# Altium schematic sheet 2312_PIC32.SchDoc
size A3; Author: Miguel Santos; Organization: ETML-ES; Address1: Avenue Recordon 1; Address2: 1004 Lausanne; Address3: Switzerland; SheetNumber: 3; SheetTotal: 7; Version: 1.0
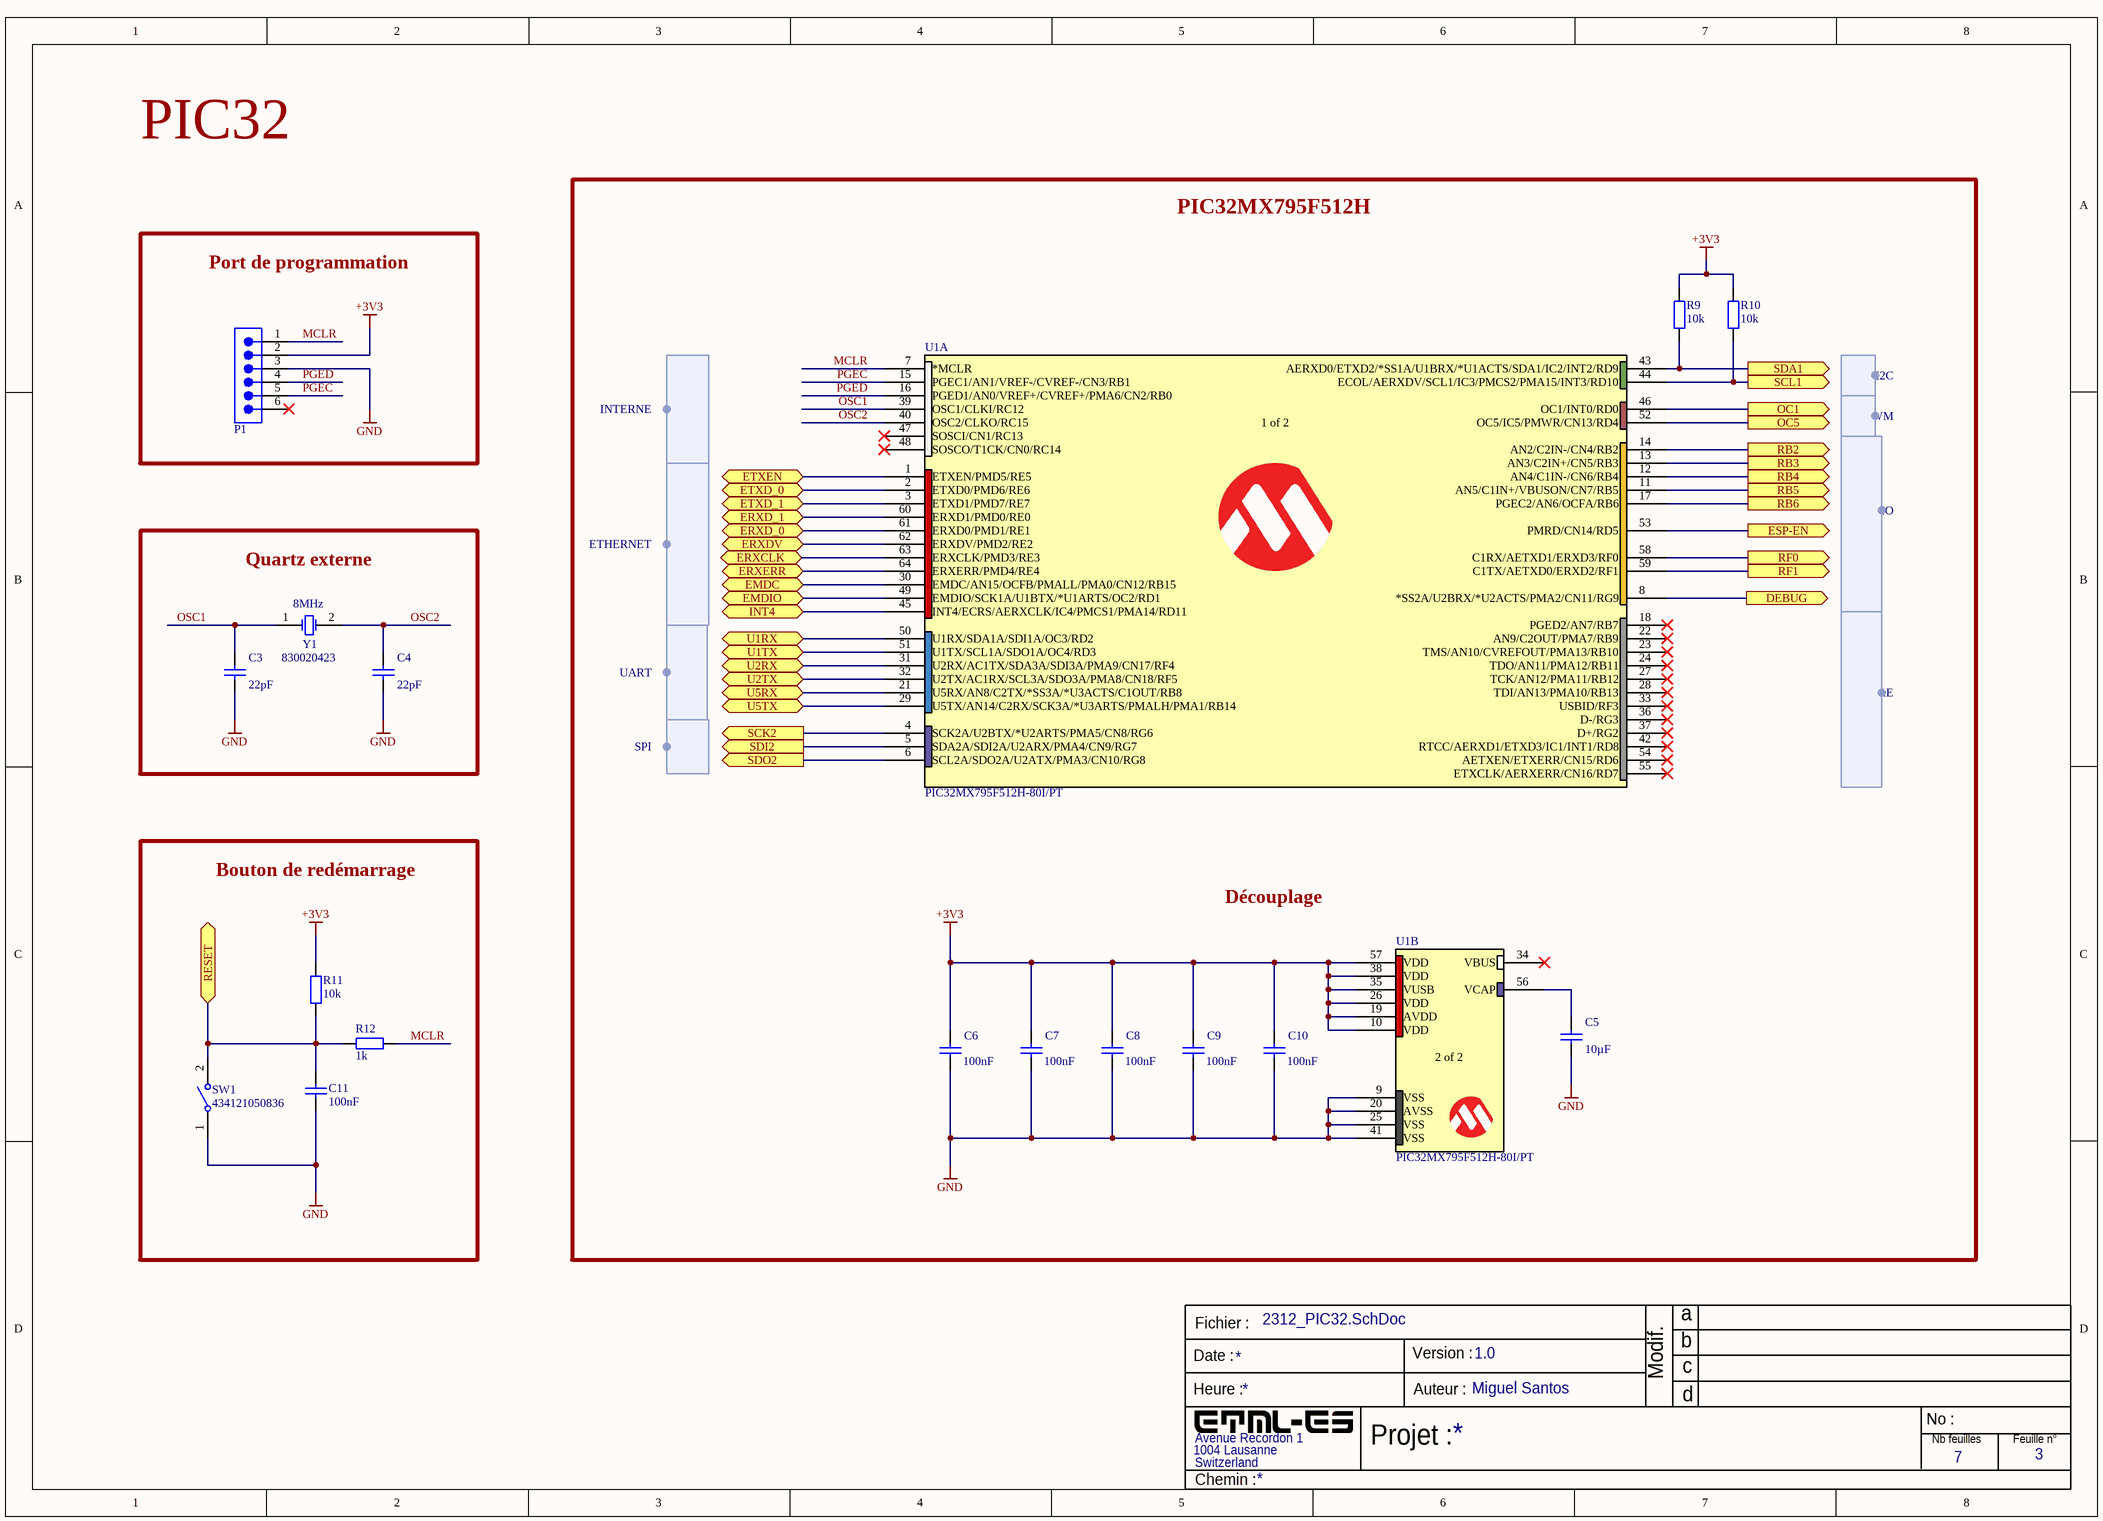
[diagram p0: 2312_PIC32.SchDoc]

## Parts
C3  Capacitance: 22pF  [WCAP-CSGP_0805_L2W1.25H0.6_Reflow]  (hidden comment: 885012007002)
C4  Capacitance: 22pF  [WCAP-CSGP_0805_L2W1.25H0.6_Reflow]  (hidden comment: 885012007002)
C5  Capacitance: 10µF  [WCAP-CSGP_0805_L2W1.25H1.25]  (hidden comment: 885012207003)
C6  Capacitance: 100nF  [WCAP-CSGP_0805_L2W1.25H0.8_Reflow]  (hidden comment: 885012207016)
C7  Capacitance: 100nF  [WCAP-CSGP_0805_L2W1.25H0.8_Reflow]  (hidden comment: 885012207016)
C8  Capacitance: 100nF  [WCAP-CSGP_0805_L2W1.25H0.8_Reflow]  (hidden comment: 885012207016)
C9  Capacitance: 100nF  [WCAP-CSGP_0805_L2W1.25H0.8_Reflow]  (hidden comment: 885012207016)
C10  Capacitance: 100nF  [WCAP-CSGP_0805_L2W1.25H0.8_Reflow]  (hidden comment: 885012207016)
C11  Capacitance: 100nF  [WCAP-CSGP_0805_L2W1.25H0.8_Reflow]  (hidden comment: 885012207016)
P1  61300611121  [61300611121]  (value not drawn)
R9  Resistance: 10k  [2312-RES-0805]  (hidden comment: RES-0805)
R10  Resistance: 10k  [2312-RES-0805]  (hidden comment: RES-0805)
R11  Resistance: 10k  [2312-RES-0805]  (hidden comment: RES-0805)
R12  Resistance: 1k  [2312-RES-0805]  (hidden comment: RES-0805)
SW1  434121050836  [WS-TASV_L6W3.5H5_4341x10508x6]
U1  PIC32MX795F512H-80I/PT  [TQFP64_10x10MC_MCH]  (parts A,B of 2)
Y1  830020423  Frequency: 8MHz  [WE-XTAL_HC49/4HSMX]

## Blocks framed on the sheet
PIC32MX795F512H: C5-C10 R9 R10 U1
Port de programmation: P1
Quartz externe: C3 C4 Y1
Bouton de redémarrage: C11 R11 R12 SW1

## Ports
DEBUG (out), EMDC (bidir), EMDIO (bidir), ERXCLK (bidir), ERXD_0 (bidir), ERXD_1 (bidir), ERXDV (bidir), ERXERR (bidir), ESP-EN (out), ETXD_0 (bidir), ETXD_1 (bidir), ETXEN (bidir), INT4 (bidir), OC1 (out), OC5 (out), RB2 (out), RB3 (out), RB4 (out), RB5 (out), RB6 (out), RESET (bidir), RF0 (out), RF1 (out), SCK2 (out), SCL1 (out), SDA1 (out), SDI2 (out), SDO2 (out), U1RX (bidir), U1TX (bidir), U2RX (bidir), U2TX (bidir), U5RX (bidir), U5TX (bidir)

## Harnesses
?: 

## Nets
+3V3: C6.2 C7.2 C8.2 C9.2 C10.2 P1.2 R9.2 R10.1 R11.1 U1.10(VDD) U1.19(AVDD) U1.26(VDD) U1.35(VUSB) U1.38(VDD) U1.57(VDD)
GND: C3.1 C4.2 C5.1 C6.1 C7.1 C8.1 C9.1 C10.1 C11.2 P1.3 SW1.1 U1.9(VSS) U1.20(AVSS) U1.25(VSS) U1.41(VSS)
DEBUG: U1.8(*SS2A/U2BRX/*U2ACTS/PMA2/CN11/RG9) ; port DEBUG
EMDC: U1.30(EMDC/AN15/OCFB/PMALL/PMA0/CN12/RB15) ; port EMDC
EMDIO: U1.49(EMDIO/SCK1A/U1BTX/*U1ARTS/OC2/RD1) ; port EMDIO
ERXCLK: U1.63(ERXCLK/PMD3/RE3) ; port ERXCLK
ERXD_0: U1.61(ERXD0/PMD1/RE1) ; port ERXD_0
ERXD_1: U1.60(ERXD1/PMD0/RE0) ; port ERXD_1
ERXDV: U1.62(ERXDV/PMD2/RE2) ; port ERXDV
ERXERR: U1.64(ERXERR/PMD4/RE4) ; port ERXERR
ESP-EN: U1.53(PMRD/CN14/RD5) ; port ESP-EN
ETXD_0: U1.2(ETXD0/PMD6/RE6) ; port ETXD_0
ETXD_1: U1.3(ETXD1/PMD7/RE7) ; port ETXD_1
ETXEN: U1.1(ETXEN/PMD5/RE5) ; port ETXEN
INT4: U1.45(INT4/ECRS/AERXCLK/IC4/PMCS1/PMA14/RD11) ; port INT4
MCLR: P1.1 R12.2 U1.7(*MCLR)
OC1: U1.46(OC1/INT0/RD0) ; port OC1
OC5: U1.52(OC5/IC5/PMWR/CN13/RD4) ; port OC5
OSC1: C3.2 U1.39(OSC1/CLKI/RC12) Y1.1(OSC1)
OSC2: C4.1 U1.40(OSC2/CLKO/RC15) Y1.2(OSC2)
PGEC: P1.5 U1.15(PGEC1/AN1/VREF-/CVREF-/CN3/RB1)
PGED: P1.4 U1.16(PGED1/AN0/VREF+/CVREF+/PMA6/CN2/RB0)
RB2: U1.14(AN2/C2IN-/CN4/RB2) ; port RB2
RB3: U1.13(AN3/C2IN+/CN5/RB3) ; port RB3
RB4: U1.12(AN4/C1IN-/CN6/RB4) ; port RB4
RB5: U1.11(AN5/C1IN+/VBUSON/CN7/RB5) ; port RB5
RB6: U1.17(PGEC2/AN6/OCFA/RB6) ; port RB6
RESET: C11.1 R11.2 R12.1 SW1.2 ; port RESET
RF0: U1.58(C1RX/AETXD1/ERXD3/RF0) ; port RF0
RF1: U1.59(C1TX/AETXD0/ERXD2/RF1) ; port RF1
SCK2: U1.4(SCK2A/U2BTX/*U2ARTS/PMA5/CN8/RG6) ; port SCK2
SCL1: R10.2 U1.44(ECOL/AERXDV/SCL1/IC3/PMCS2/PMA15/INT3/RD10) ; port SCL1
SDA1: R9.1 U1.43(AERXD0/ETXD2/*SS1A/U1BRX/*U1ACTS/SDA1/IC2/INT2/RD9) ; port SDA1
SDI2: U1.5(SDA2A/SDI2A/U2ARX/PMA4/CN9/RG7) ; port SDI2
SDO2: U1.6(SCL2A/SDO2A/U2ATX/PMA3/CN10/RG8) ; port SDO2
U1RX: U1.50(U1RX/SDA1A/SDI1A/OC3/RD2) ; port U1RX
U1TX: U1.51(U1TX/SCL1A/SDO1A/OC4/RD3) ; port U1TX
U2RX: U1.31(U2RX/AC1TX/SDA3A/SDI3A/PMA9/CN17/RF4) ; port U2RX
U2TX: U1.32(U2TX/AC1RX/SCL3A/SDO3A/PMA8/CN18/RF5) ; port U2TX
U5RX: U1.21(U5RX/AN8/C2TX/*SS3A/*U3ACTS/C1OUT/RB8) ; port U5RX
U5TX: U1.29(U5TX/AN14/C2RX/SCK3A/*U3ARTS/PMALH/PMA1/RB14) ; port U5TX
NetC5_2: C5.2 U1.56(VCAP)

Not connected (* = marked no-connect by the designer): P1 6*; U1 18(PGED2/AN7/RB7)* 22(AN9/C2OUT/PMA7/RB9)* 23(TMS/AN10/CVREFOUT/PMA13/RB10)* 24(TDO/AN11/PMA12/RB11)* 27(TCK/AN12/PMA11/RB12)* 28(TDI/AN13/PMA10/RB13)* 33(USBID/RF3)* 34(VBUS)* 36(D-/RG3)* 37(D+/RG2)* 42(RTCC/AERXD1/ETXD3/IC1/INT1/RD8)* 47(SOSCI/CN1/RC13)* 48(SOSCO/T1CK/CN0/RC14)* 54(AETXEN/ETXERR/CN15/RD6)* 55(ETXCLK/AERXERR/CN16/RD7)*

## Notes on the sheet
- PIC32
- I2C
- INTERNE
- PWM
- GPIO
- ETHERNET
- UART
- LIBRE
- SPI
- Découplage
- Fichier :
- a
- Date :
- Heure :
- Version :
- Auteur :
- Modif.
- b
- c
- d
- Projet :
- No :
- Nb feuilles
- Feuille n°
- Chemin :
- (in symbol PIC32MX795F512H-80I/PT, part A) 1 of 2
- (in symbol PIC32MX795F512H-80I/PT, part B) 2 of 2

## Library data of the parts
C3 C4 = 885012007002: WCAP-CSGP Multilayer Ceramic Chip Capacitor, General Purpose, size 0805, NP0, 22pF, 10VDC; Manufacturer: Wurth Elektronik; Case/Size Code: 0805; Capacitance Tolerance: +/-5%; Insulation Resistance: 10GΩ; Q Factor: 840; Rated Voltage (DC): 10V; Technical Reference: NP00805220J010DFCT10000; Manufacturer Part Number: 885012007002; Category: Multilayer Ceramic Chip Capacitors; Match Code: WCAP-CSGP; ComponentLink1Description: Website Link; ComponentLink1URL: https://www.we-online.com/redexpert/article/885012007002?ad; ComponentLink2Description: Datasheet Link; ComponentLink2URL: https://www.we-online.com/redexpert/spec/885012007002?ad; Mount: Surface Mount; Operating Temperature Max: 125°C; Operating Temperature Min: -55°C; Packaging: Tape and Reel; Length: 2mm; Width: 1.25mm; Height: 0.6mm; Ceramic Type: NP0
C5 = 885012207003: WCAP-CSGP Multilayer Ceramic Chip Capacitor, General Purpose, size 0805, X7R, 10µF, 6.3VDC; Manufacturer: Wurth Elektronik; Case/Size Code: 0805; Capacitance Tolerance: +/-10%; Dissipation Factor: 10%; Insulation Resistance: 0.01GΩ; Rated Voltage (DC): 6.3V; Technical Reference: X7R0805106K6R3DFCT10000; Manufacturer Part Number: 885012207003; Category: Multilayer Ceramic Chip Capacitors; Match Code: WCAP-CSGP; ComponentLink1Description: Website Link; ComponentLink1URL: https://www.we-online.com/redexpert/article/885012207003?ad; ComponentLink2Description: Datasheet Link; ComponentLink2URL: https://www.we-online.com/redexpert/spec/885012207003?ad; Mount: Surface Mount; Operating Temperature Max: 125°C; Operating Temperature Min: -55°C; Packaging: Tape and Reel; Length: 2mm; Width: 1.25mm; Height: 1.25mm; Ceramic Type: X7R
C6-C11 = 885012207016: WCAP-CSGP Multilayer Ceramic Chip Capacitor, General Purpose, size 0805, X7R, 100nF, 10VDC; Manufacturer: Wurth Elektronik; Case/Size Code: 0805; Capacitance Tolerance: +/-10%; Dissipation Factor: 5%; Insulation Resistance: 5GΩ; Rated Voltage (DC): 10V; Technical Reference: X7R0805104K010DFCT10000; Manufacturer Part Number: 885012207016; Category: Multilayer Ceramic Chip Capacitors; Match Code: WCAP-CSGP; ComponentLink1Description: Website Link; ComponentLink1URL: https://www.we-online.com/redexpert/article/885012207016?ad; ComponentLink2Description: Datasheet Link; ComponentLink2URL: https://www.we-online.com/redexpert/spec/885012207016?ad; Mount: Surface Mount; Operating Temperature Max: 125°C; Operating Temperature Min: -55°C; Packaging: Tape and Reel; Length: 2mm; Width: 1.25mm; Height: 0.8mm; Ceramic Type: X7R
P1 = 61300611121: WR-PHD Pin Header, THT, Vertical, pitch 2.54mm, 1 Row, 6P; Manufacturer: Wurth Elektronik; Contact Resistance: 20mΩ; Rated Current: 3A; Working Voltage: 250V; Withstanding Voltage: 500V; ComponentLink1Description: Website Link; ComponentLink1URL: https://www.we-online.com/redexpert/article/61300611121?ad; ComponentLink2Description: Datasheet Link; ComponentLink2URL: https://www.we-online.com/redexpert/spec/61300611121?ad; Manufacturer Part Number: 61300611121; Category: Board-to-Board Connectors; Match Code: WR-PHD; Mount: Through Hole; Operating Temperature Max: 105°C; Operating Temperature Min: -40°C; Packaging: Bag; Gender: Pin Header; Number of Pins: 6; Number of Rows: 1; Orientation: Vertical; Pitch: 2.54mm
R9-R11 = RES-0805: SMD Resistor 0805, 10kΩ
R12 = RES-0805: SMD Resistor 0805, 1kΩ
SW1 = 434121050836: WS-TASV SMT Tact Switch, L6 x W3.5 x H5mm, 360g, SPST-NO, 12V, 50mA; Manufacturer: Wurth Elektronik; Washable: No; Manufacturer Part Number: 434121050836; Category: Tact Switches; Match Code: WS-TASV; ComponentLink1Description: Website Link; ComponentLink1URL: https://www.we-online.com/redexpert/article/434121050836?ad; ComponentLink2Description: Datasheet Link; ComponentLink2URL: https://www.we-online.com/redexpert/spec/434121050836?ad; Mount: Surface Mount; Operating Temperature Max: 85°C; Operating Temperature Min: -40°C; Packaging: Tape and Reel; Length: 6mm; Width: 3.5mm; Height: 5mm; Circuit: SPST-NO; Contact Material: Stainless Steel; Contact Plating: Silver; Operation Force: 360g; Rated Current: 50mA; Rated Voltage (DC): 12V; Terminal Material: Copper Alloy; Terminal Plating: Silver
U1 = PIC32MX795F512H-80I/PT: No Description Available; Mfr_Name: Microchip; RefDes: RefDes; Type: Type
Y1 = 830020423: WE-XTAL Quartz Crystal, SMT, HC49/4HSMX, 8MHz, +/-30ppm; Manufacturer: Wurth Elektronik; Frequency Stability: +/-50ppm; Load Capacitance: 18pF; ComponentLink1Description: Website Link; ComponentLink1URL: https://www.we-online.com/redexpert/article/830020423?ad; ComponentLink2Description: Datasheet Link; ComponentLink2URL: https://www.we-online.com/redexpert/spec/830020423?ad; Manufacturer Part Number: 830020423; Category: Crystals; Match Code: WE-XTAL; Mount: Surface Mount; Operating Temperature Max: 70°C; Operating Temperature Min: -20°C; Packaging: Tape and Reel; Case/Size Code: HC49/4HSMX; Length: 11.4mm; Width: 4.9mm; Height: 4.3mm; Frequency Tolerance: +/-30ppm